# Altium project 28_28.PrjPcb
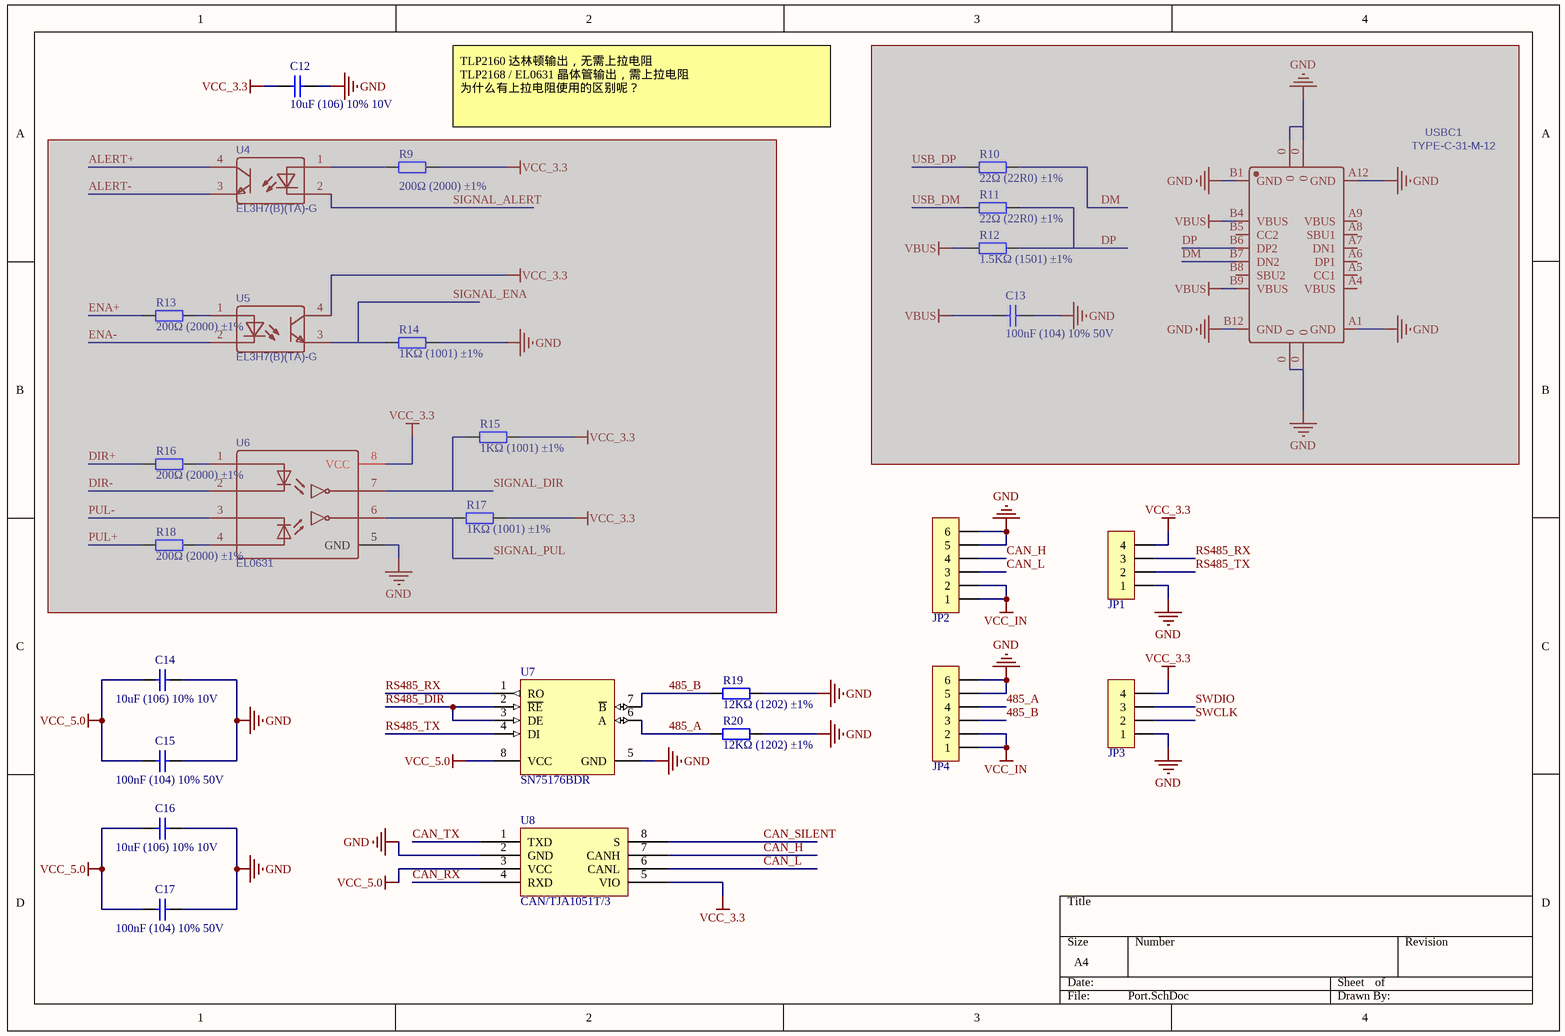
[diagram p0: Port.SchDoc]
2 sheets, 53 parts. Net scope: global (net labels, ports and power ports of the same name join across sheets).
Board file: 28_28.PcbDoc
Sheets:
  Port.SchDoc
  Power.SchDoc

## Sheet Port.SchDoc
size A4; SheetNumber: 3; SheetTotal: 5

### Parts
C12  10uF (106) 10% 10V  [0603_C]
C13  100nF (104) 10% 50V  [0603_C]  (masked out: inside a compile mask, not in the netlist)
C14  10uF (106) 10% 10V  [0603_C]
C15  100nF (104) 10% 50V  [0603_C]
C16  10uF (106) 10% 10V  [0603_C]
C17  100nF (104) 10% 50V  [0603_C]
JP1  HDR-1X4  [HDR2.54-LI-4P]  (value not drawn)
JP2  HDR-1X6  [MX 1.25-WI-6P]  (value not drawn)
JP3  HDR-1X4  [HDR2.54-LI-4P]  (value not drawn)
JP4  HDR-1X6  [MX 1.25-WI-6P]  (value not drawn)
R9  200Ω (2000) ±1%  [0603_R]  (masked out: inside a compile mask, not in the netlist)
R10  22Ω (22R0) ±1%  [0603_R]  (masked out: inside a compile mask, not in the netlist)
R11  22Ω (22R0) ±1%  [0603_R]  (masked out: inside a compile mask, not in the netlist)
R12  1.5KΩ (1501) ±1%  [0603_R]  (masked out: inside a compile mask, not in the netlist)
R13  200Ω (2000) ±1%  [0603_R]  (masked out: inside a compile mask, not in the netlist)
R14  1KΩ (1001) ±1%  [0603_R]  (masked out: inside a compile mask, not in the netlist)
R15  1KΩ (1001) ±1%  [0603_R]  (masked out: inside a compile mask, not in the netlist)
R16  200Ω (2000) ±1%  [0603_R]  (masked out: inside a compile mask, not in the netlist)
R17  1KΩ (1001) ±1%  [0603_R]  (masked out: inside a compile mask, not in the netlist)
R18  200Ω (2000) ±1%  [0603_R]  (masked out: inside a compile mask, not in the netlist)
R19  12KΩ (1202) ±1%  [0603_R]
R20  12KΩ (1202) ±1%  [0603_R]
U4  EL3H7(B)(TA)-G  [SOP4]  (masked out: inside a compile mask, not in the netlist)
U5  EL3H7(B)(TA)-G  [SOP4]  (masked out: inside a compile mask, not in the netlist)
U6  EL0631  [SOIC-8_L5.0-W4.0-P1.27-LS6.0-BL]  (masked out: inside a compile mask, not in the netlist)
U7  SN75176BDR  [SOIC_8]
U8  CAN/TJA1051T/3  [SOIC_8]
USBC1  TYPE-C-31-M-12  [USB-C_SMD-TYPE-C-31-M-12]  (masked out: inside a compile mask, not in the netlist)

### Nets
GND: C12.1 C14.2 C15.2 C16.2 C17.2 JP1.1 JP2.5 JP2.6 JP3.1 JP4.5 JP4.6 R19.2 R20.2 U7.5(GND) U8.2(GND)
VCC_3.3: C12.2 JP1.4 JP3.4 U8.5(VIO)
VCC_5.0: C14.1 C15.1 C16.1 C17.1 U7.8(VCC) U8.3(VCC)
VCC_IN: JP2.1 JP2.2 JP4.1 JP4.2
485_A: JP4.4 R20.1 U7.6(A)
485_B: JP4.3 R19.1 U7.7(~{B})
CAN_H: JP2.4 U8.7(CANH)
CAN_L: JP2.3 U8.6(CANL)
CAN_RX: U8.4(RXD)
CAN_SILENT: U8.8(S)
CAN_TX: U8.1(TXD)
RS485_DIR: U7.2(~{RE}) U7.3(DE)
RS485_RX: JP1.3 U7.1(RO)
RS485_TX: JP1.2 U7.4(DI)
SWCLK: JP3.2
SWDIO: JP3.3

### Notes on the sheet
- (near R9) TLP2160 达林顿输出，无需上拉电阻
  TLP2168 / EL0631 晶体管输出，需上拉电阻
  为什么有上拉电阻使用的区别呢？

### Library data of the parts
C12 C14 C16 = 0603 10uF (106) 10% 10V: 贴片电容; ComponentLink1Description: 供应商链接; ComponentLink1URL: http://www.szlcsc.com/product/details_20411.html; Package: 0603; Supplier: LC; SuppliersPartNumber: C19702
C13 C15 C17 = 0603 100nF (104) 10% 50V: 贴片电容; ComponentLink1Description: 供应商链接; ComponentLink1URL: http://www.szlcsc.com/product/details_15331.html; Package: 0603; Supplier: LC; SuppliersPartNumber: C14663
JP1 JP3 = Header 4: 4P接插件; 1.库作者: 冰凌猫; 2.库版本: v2.0 (2021.03.30); 3.交流分享: Q群514746572,开源更新,欢迎一起交流学习PCB设计; 4.作者声明: 旨为整合最全库集,欢迎转载,禁止商用！-冰凌猫; 5.备注说明: 该库已二次整合过网上各热销库,基本最全,无需重复搜购安装; 0.0_BOM名称: 4P接插件
JP2 JP4 = Header 6: 6P接插件; 1.库作者: 冰凌猫; 2.库版本: v2.0 (2021.03.30); 3.交流分享: Q群514746572,开源更新,欢迎一起交流学习PCB设计; 4.作者声明: 旨为整合最全库集,欢迎转载,禁止商用！-冰凌猫; 5.备注说明: 该库已二次整合过网上各热销库,基本最全,无需重复搜购安装; 0.0_BOM名称: 6P接插件
R9 R13 R16 R18 = 0603 200Ω (2000) 1%: 贴片电阻; ComponentLink1Description: 供应商链接; ComponentLink1URL: http://www.szlcsc.com/product/details_8708.html; Package: 0603; Supplier: LC; SuppliersPartNumber: C8218
R10 R11 = 0603 22Ω (22R0) 1%: 贴片电阻; ComponentLink1Description: 供应商链接; ComponentLink1URL: http://www.szlcsc.com/product/details_24078.html; Package: 0603; Supplier: LC; SuppliersPartNumber: C23345
R12 = 0603 1.5KΩ (1501) 1%: 贴片电阻; ComponentLink1Description: 供应商链接; ComponentLink1URL: http://www.szlcsc.com/product/details_23570.html; Package: 0603; Supplier: LC; SuppliersPartNumber: C22843
R14 R15 R17 = 0603 1KΩ (1001) 1%: 贴片电阻; ComponentLink1Description: 供应商链接; ComponentLink1URL: http://www.szlcsc.com/product/details_21904.html; Package: 0603; Supplier: LC; SuppliersPartNumber: C21190
R19 R20 = 0603 12KΩ (1202) 1%: 贴片电阻; ComponentLink1Description: 供应商链接; ComponentLink1URL: http://www.szlcsc.com/product/details_23517.html; Package: 0603; Supplier: LC; SuppliersPartNumber: C22790
U4 U5 = EL357N(A)(TA)-G: 光耦; BOM_Manufacturer: EVERLIGHT; Contributor: LCSC; SMT Type: Extend; BOM_Supplier: LCSC; BOM_Manufacturer Part: EL357N(A)(TA)-G; BOM_Supplier Part: C142286; BOM_LCSC Assembly: Yes; spicePre: U; spiceSymbolName: EL357N(A)(TA)-G
U6 = TLP2160(TP,F): 光耦; BOM_Manufacturer: TOSHIBA; Contributor: LCSC; BOM_Supplier: LCSC; BOM_Supplier Part: C393887; BOM_Manufacturer Part: TLP2160(TP,F); spicePre: U; spiceSymbolName: TLP2160(TP,F)
U7 = SN75176BDR_[C7063]: RS-485/RS-422; ComponentLink1Description: 供应商链接; ComponentLink1URL: http://www.szlcsc.com/product/details_7535.html; Package: SOIC-8_150mil; Supplier: LC; SuppliersPartNumber: C7063
U8 = CAN/TJA1051T/3_[C38695]: CAN; ComponentLink1Description: 供应商链接; ComponentLink1URL: http://www.szlcsc.com/product/details_39678.html; Package: SOIC-8_150mil; Supplier: LC; SuppliersPartNumber: C38695
USBC1 = TYPE-C-31-M-12: TYPE-C USB插座; BOM_Manufacturer: Rectangular Connectors - Contacts; Contributor: LCSC; BOM_Supplier: LCSC; BOM_Supplier Part: C165948; BOM_Manufacturer Part: TYPE-C-31-M-12; spicePre: U; spiceSymbolName: TYPE-C-31-M-12

## Sheet Power.SchDoc
size A4; SheetNumber: 4; SheetTotal: 5
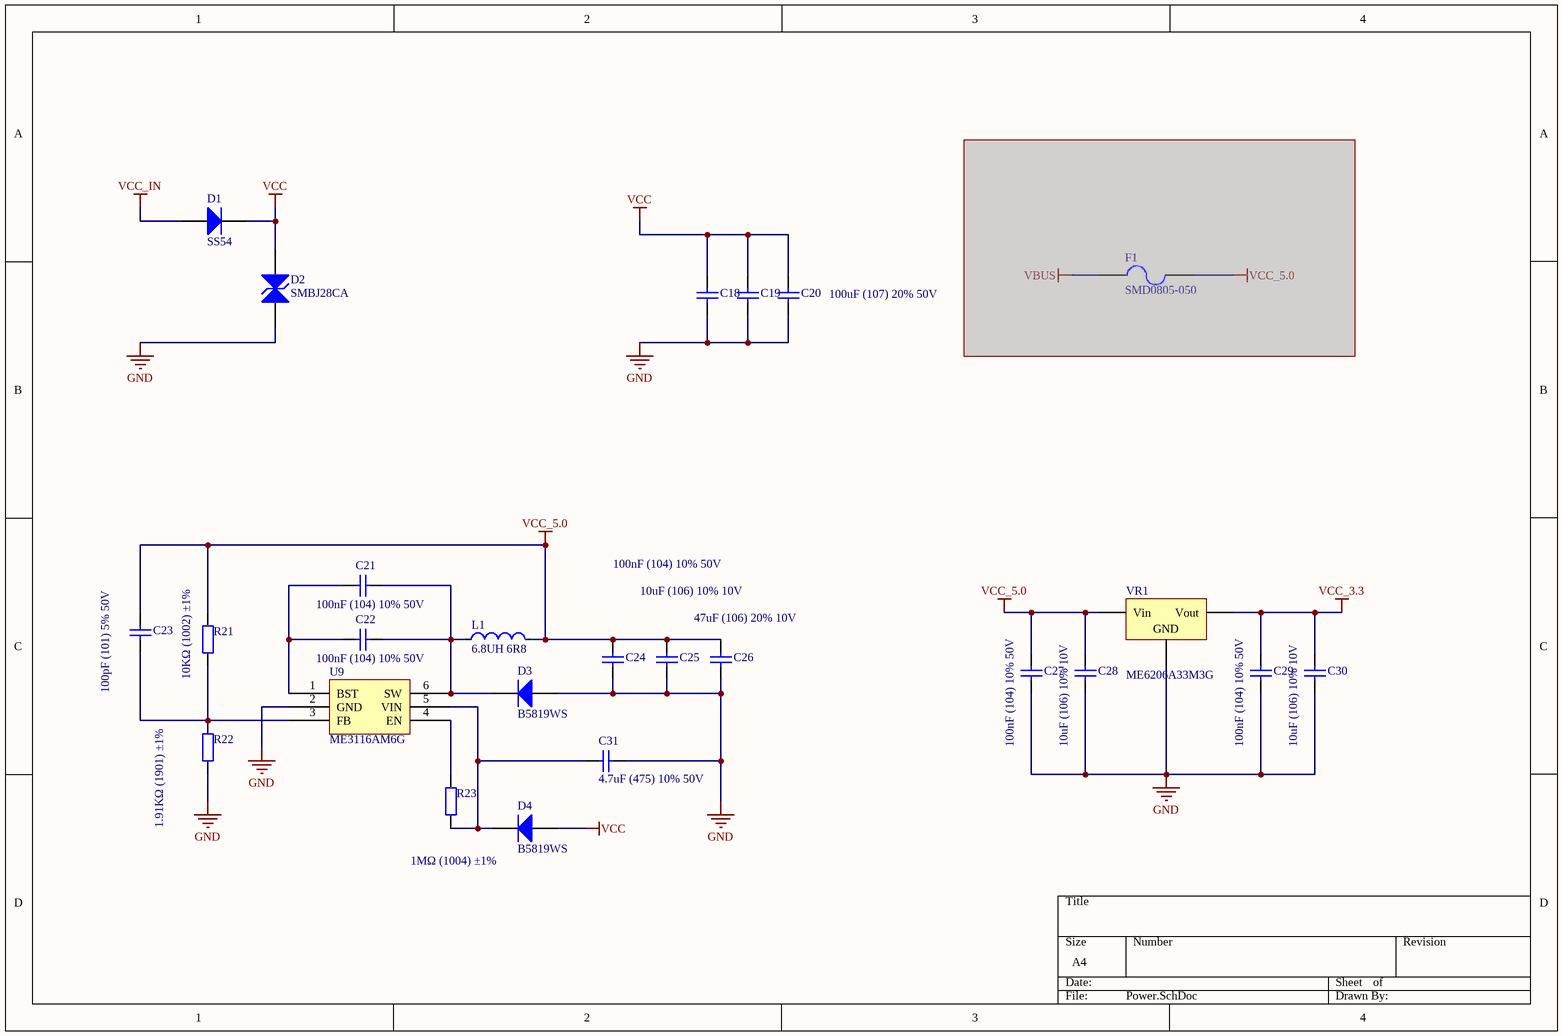
[diagram p1: Power.SchDoc]

### Parts
C18  100uF (107) 20% 50V  [C 1210_L]
C19  100uF (107) 20% 50V  [C 1210_L]  (value not drawn)
C20  100uF (107) 20% 50V  [C 1210_L]  (value not drawn)
C21  100nF (104) 10% 50V  [0603_C]
C22  100nF (104) 10% 50V  [0603_C]
C23  100pF (101) 5% 50V  [0603_C]
C24  100nF (104) 10% 50V  [0603_C]
C25  10uF (106) 10% 10V  [0603_C]
C26  47uF (106) 20% 10V  [1206_C]
C27  100nF (104) 10% 50V  [0603_C]
C28  10uF (106) 10% 10V  [0603_C]
C29  100nF (104) 10% 50V  [0603_C]
C30  10uF (106) 10% 10V  [0603_C]
C31  4.7uF (475) 10% 50V  [1206_C]
D1  SS54  [SMB]
D2  SMBJ28CA  [SMB]
D3  B5819WS  [SOD-323]
D4  B5819WS  [SOD-323]
F1  SMD0805-050  [FU 0805]  (masked out: inside a compile mask, not in the netlist)
L1  6.8UH 6R8  [L 1206]
R21  10KΩ (1002) ±1%  [0603_R]
R22  1.91KΩ (1901) ±1%  [0603_R]
R23  1MΩ (1004) ±1%  [0603_R]
U9  ME3116AM6G  [SOT-23-6]
VR1  ME6206A33M3G  [SOT-23-3L]

### Nets
GND: C18.1 C19.1 C20.1 C24.1 C25.1 C26.1 C27.1 C28.1 C29.1 C30.1 C31.2 D2.1(A) D3.1(A) R22.1 U9.2(GND) VR1.1(GND)
VCC: C18.2 C19.2 C20.2 D1.2(K) D2.2(K) D4.1(A)
VCC_3.3: C29.2 C30.2 VR1.2(Vout)
VCC_5.0: C23.2 C24.2 C25.2 C26.2 C27.2 C28.2 L1.2 R21.2 VR1.3(Vin)
VCC_IN: D1.1(A)
NetC21_1: C21.1 C22.1 U9.1(BST)
NetC21_2: C21.2 C22.2 D3.2(K) L1.1 U9.6(SW)
NetC23_1: C23.1 R21.1 R22.2 U9.3(FB)
NetC31_1: C31.1 D4.2(K) R23.1 U9.5(VIN)
NetR23_2: R23.2 U9.4(EN)

### Library data of the parts
C18-C20 = Cap: 贴片电容; Published: 8-Jun-2000; LatestRevisionDate: 17-Jul-2002; LatestRevisionNote: Re-released for DXP Platform.; PackageReference: RAD-0.3; Publisher: Altium Limited; PackageDescription: Radial Cap, Thru-Hole; 2 Leads; 0.3 in Pin Spacing
C21 C22 C24 C27 C29 = 0603 100nF (104) 10% 50V: 贴片电容; ComponentLink1Description: 供应商链接; ComponentLink1URL: http://www.szlcsc.com/product/details_15331.html; Package: 0603; Supplier: LC; SuppliersPartNumber: C14663
C23 = 0603 100pF (101) 5% 50V: 贴片电容; ComponentLink1Description: 供应商链接; ComponentLink1URL: http://www.szlcsc.com/product/details_15530.html; Package: 0603; Supplier: LC; SuppliersPartNumber: C14858
C25 C28 C30 = 0603 10uF (106) 10% 10V: 贴片电容; ComponentLink1Description: 供应商链接; ComponentLink1URL: http://www.szlcsc.com/product/details_20411.html; Package: 0603; Supplier: LC; SuppliersPartNumber: C19702
C26 = 1206 10uF (106) 10% 50V: 贴片电容; ComponentLink1Description: 供应商链接; ComponentLink1URL: http://www.szlcsc.com/product/details_14236.html; Package: 1206; Supplier: LC; SuppliersPartNumber: C13585
C31 = 1206 4.7uF (475) 10% 50V: 贴片电容; ComponentLink1Description: 供应商链接; ComponentLink1URL: http://www.szlcsc.com/product/details_30577.html; Package: 1206; Supplier: LC; SuppliersPartNumber: C29823
D1 = SMA(DO-214AC) SS54: 二极管; ComponentLink1Description: 供应商链接; ComponentLink1URL: http://www.szlcsc.com/product/details_23178.html; Package: SMA(DO-214AC); Supplier: LC; SuppliersPartNumber: C22452
D2 = SMB/DO-214AA P6SMB6.8CA: TVS; ComponentLink1Description: 供应商链接; ComponentLink1URL: http://www.szlcsc.com/product/details_79530.html; Package: SMB/DO-214AA; Supplier: LC; SuppliersPartNumber: C78395
D3 D4 = SOD-323 1N4148WS T4: 二极管; ComponentLink1Description: 供应商链接; ComponentLink1URL: http://www.szlcsc.com/product/details_2485.html; Package: SOD-323; Supplier: LC; SuppliersPartNumber: C2128
F1 = Fuse 2_1: 自恢复保险丝 500mA; Published: 8-Jun-2000; LatestRevisionDate: 17-Jul-2002; LatestRevisionNote: Re-released for DXP Platform.; PackageReference: PIN-W2/E2.8; Publisher: Altium Limited; PackageDescription: Thru-Hole; 2 Leads
L1 = IND: 贴片电感
R21 = 0603 10KΩ (1002) 1%: 贴片电阻; ComponentLink1Description: 供应商链接; ComponentLink1URL: http://www.szlcsc.com/product/details_26547.html; Package: 0603; Supplier: LC; SuppliersPartNumber: C25804
R22 = 0603 1KΩ (1001) 1%_1: 贴片电阻; ComponentLink1Description: 供应商链接; ComponentLink1URL: http://www.szlcsc.com/product/details_21904.html; Package: 0603; Supplier: LC; SuppliersPartNumber: C21190
R23 = 0603 1MΩ (1004) 1%: 贴片电阻; ComponentLink1Description: 供应商链接; ComponentLink1URL: http://www.szlcsc.com/product/details_23662.html; Package: 0603; Supplier: LC; SuppliersPartNumber: C22935
U9 = MP2451DT-LF-Z_[C14123]: DC-DC芯片; ComponentLink1Description: 供应商链接; ComponentLink1URL: http://www.szlcsc.com/product/details_14780.html; Package: SOT-23-6; Supplier: LC; SuppliersPartNumber: C14123
VR1 = SOT-23 XC6206P332MR: 低压差线性稳压(LDO); ComponentLink1Description: 供应商链接; ComponentLink1URL: http://www.szlcsc.com/product/details_5896.html; Package: SOT-23; Supplier: LC; SuppliersPartNumber: C5446

## Nets that join several sheets
GND: Port (15 pins), Power (16 pins)
VCC_3.3: Port (C12.2 JP1.4 JP3.4 U8.5), Power (C29.2 C30.2 VR1.2)
VCC_5.0: Port (6 pins), Power (9 pins)
VCC_IN: Port (JP2.1 JP2.2 JP4.1 JP4.2), Power (D1.1)